# EAGLE design placa_conexoes (EAGLE 7.7.0)
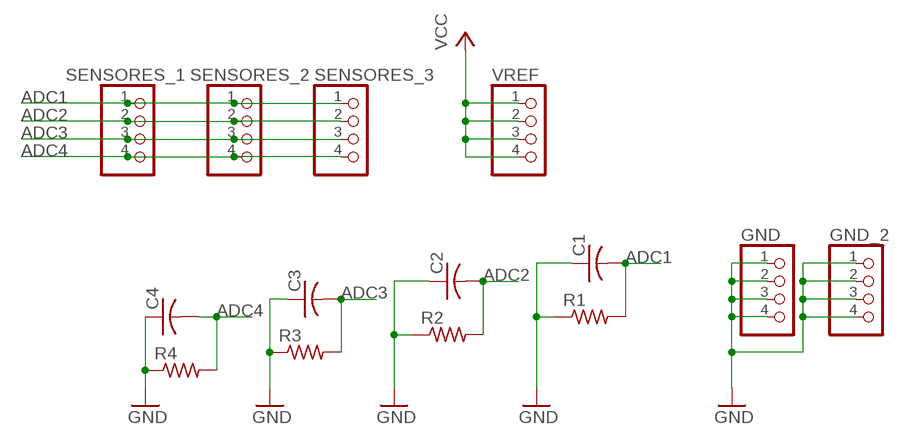
[diagram p0: schematic, sheet 1]

## Parts
C1  C-US025-025X050  [C025-025X050]
C2  C-US025-025X050  [C025-025X050]
C3  C-US025-025X050  [C025-025X050]
C4  C-US025-025X050  [C025-025X050]
GND  PINHD-1X4  [1X04]
GND_2  PINHD-1X4  [1X04]
R1  R-US_0207/9  [0207/9]
R2  R-US_0207/9  [0207/9]
R3  R-US_0207/9  [0207/9]
R4  R-US_0207/9  [0207/9]
SENSORES_1  PINHD-1X4  [1X04]
SENSORES_2  PINHD-1X4  [1X04]
SENSORES_3  PINHD-1X4  [1X04]
VREF  PINHD-1X4  [1X04]

## Nets
ADC1: C1.2 R1.2 SENSORES_1.1 SENSORES_2.1 SENSORES_3.1
ADC2: C2.2 R2.2 SENSORES_1.2 SENSORES_2.2 SENSORES_3.2
ADC3: C3.2 R3.2 SENSORES_1.3 SENSORES_2.3 SENSORES_3.3
ADC4: C4.2 R4.2 SENSORES_1.4 SENSORES_2.4 SENSORES_3.4
GND: C1.1 C2.1 C3.1 C4.1 GND.1 GND.2 GND.3 GND.4 GND_2.1 GND_2.2 GND_2.3 GND_2.4 R1.1 R2.1 R3.1 R4.1
VCC: VREF.1 VREF.2 VREF.3 VREF.4

## Library data of the parts
C1-C4 = adafruit:C-US: CAPACITOR, American symbol
GND GND_2 SENSORES_1-SENSORES_3 VREF = pinhead:PINHD-1X4: PIN HEADER
R1-R4 = adafruit:R-US_: RESISTOR, American symbol

## Board
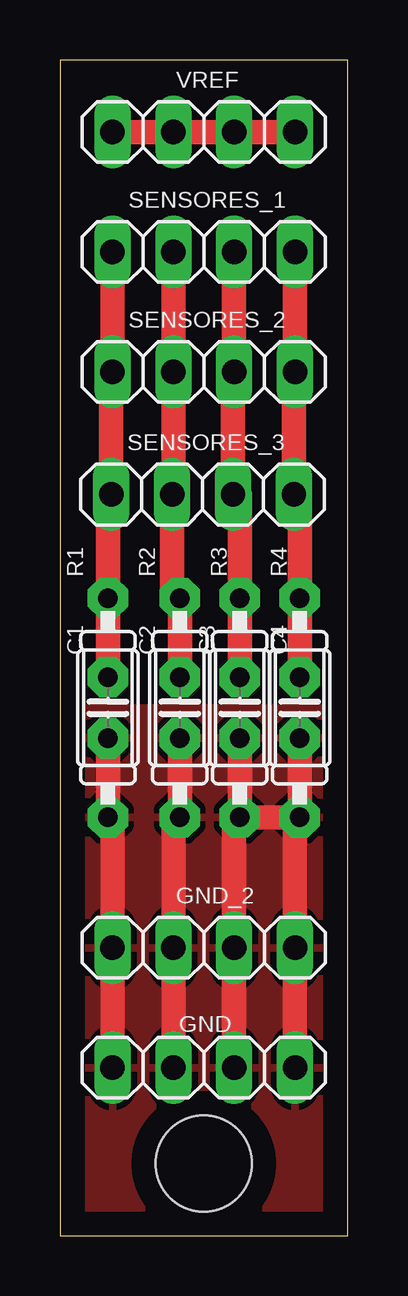
[diagram p1: board, top side]

Size 12 x 49 mm. Coordinates in mm from the lower left corner, seen from the top.
Outline: 0,0 12,0 12,49 0,49 0,0
Copper layers (1*16): Top 0.035mm / dielectric 1.5mm / Bottom 0.035mm
Design rules "default": minimum track width 10mil, minimum drill 24mil, track to track 8mil, track to pad 8mil, pad to pad 8mil, via to via 8mil, smd to smd 8mil, copper to edge 40mil, drill to drill 8mil, minimum pad ring 10mil, minimum via ring 8mil, stop-mask expansion 4mil, vias tented up to drill 0mil, thermal gap 10mil
Holes 4 mm at 6,3

### Footprints (pad centres in the part's own frame; a part is rotated, then mirrored left to right if it is on the bottom)
C025-025X050 = drill 0.813 pad 1.676 octagon: 1 -1.27,0; 2 1.27,0
1X04 = drill 1.016 long: 1 -3.81,0; 2 -1.27,0; 3 1.27,0; 4 3.81,0
0207/9 = drill 0.813 pad 1.676 octagon: 1 -4.572,0; 2 4.572,0

### Placement (x,y rotation side)
C1  2,22 90 top
C2  5,22 90 top
C3  7.5,22 90 top
C4  10,22 90 top
GND  6,7 180 top
GND_2  6,12 0 top
R1  2,22 90 top
R2  5,22 90 top
R3  7.5,22 90 top
R4  10,22 90 top
SENSORES_1  6,41 0 top
SENSORES_2  6,36 0 top
SENSORES_3  5.95,30.89 0 top
VREF  6,46 0 top

### Tracks (layer width: path | path; a pad name or v marks a point on that pad's centre or on a via)
ADC1
  Top 1.016: SENSORES_1.1 SENSORES_2.1 2.14,36 SENSORES_3.1 2,30.89 R1.2 C1.2
ADC2
  Top 1.016: C2.2 R2.2 4.68,26.57 SENSORES_3.2 4.73,30.89 SENSORES_2.2 SENSORES_1.2
ADC3
  Top 1.016: SENSORES_1.3 SENSORES_2.3 7.22,36 SENSORES_3.3 7.5,30.89 R3.2 C3.2
ADC4
  Top 1.016: SENSORES_1.4 SENSORES_2.4 9.76,36 SENSORES_3.4 10,30.89 R4.2 C4.2
GND
  Top 1.016: C1.1 R1.1 2.19,17.43 GND_2.1 GND.4 | C2.1 R2.1 4.73,17.43 GND_2.2 GND.3 | C3.1 R3.1 7.27,17.43 | 7.27,17.43 GND_2.3 GND.2 | C4.1 R4.1 | 7.27,17.43 9.81,17.43 GND_2.4 GND.1
  pour Top: 11,22 0.5,22 0.5,1.5 2,0 10,0 11,1
VCC
  Top 1.016: VREF.1 VREF.2 VREF.3 VREF.4